# Altium project ZS-005.PrjPcb
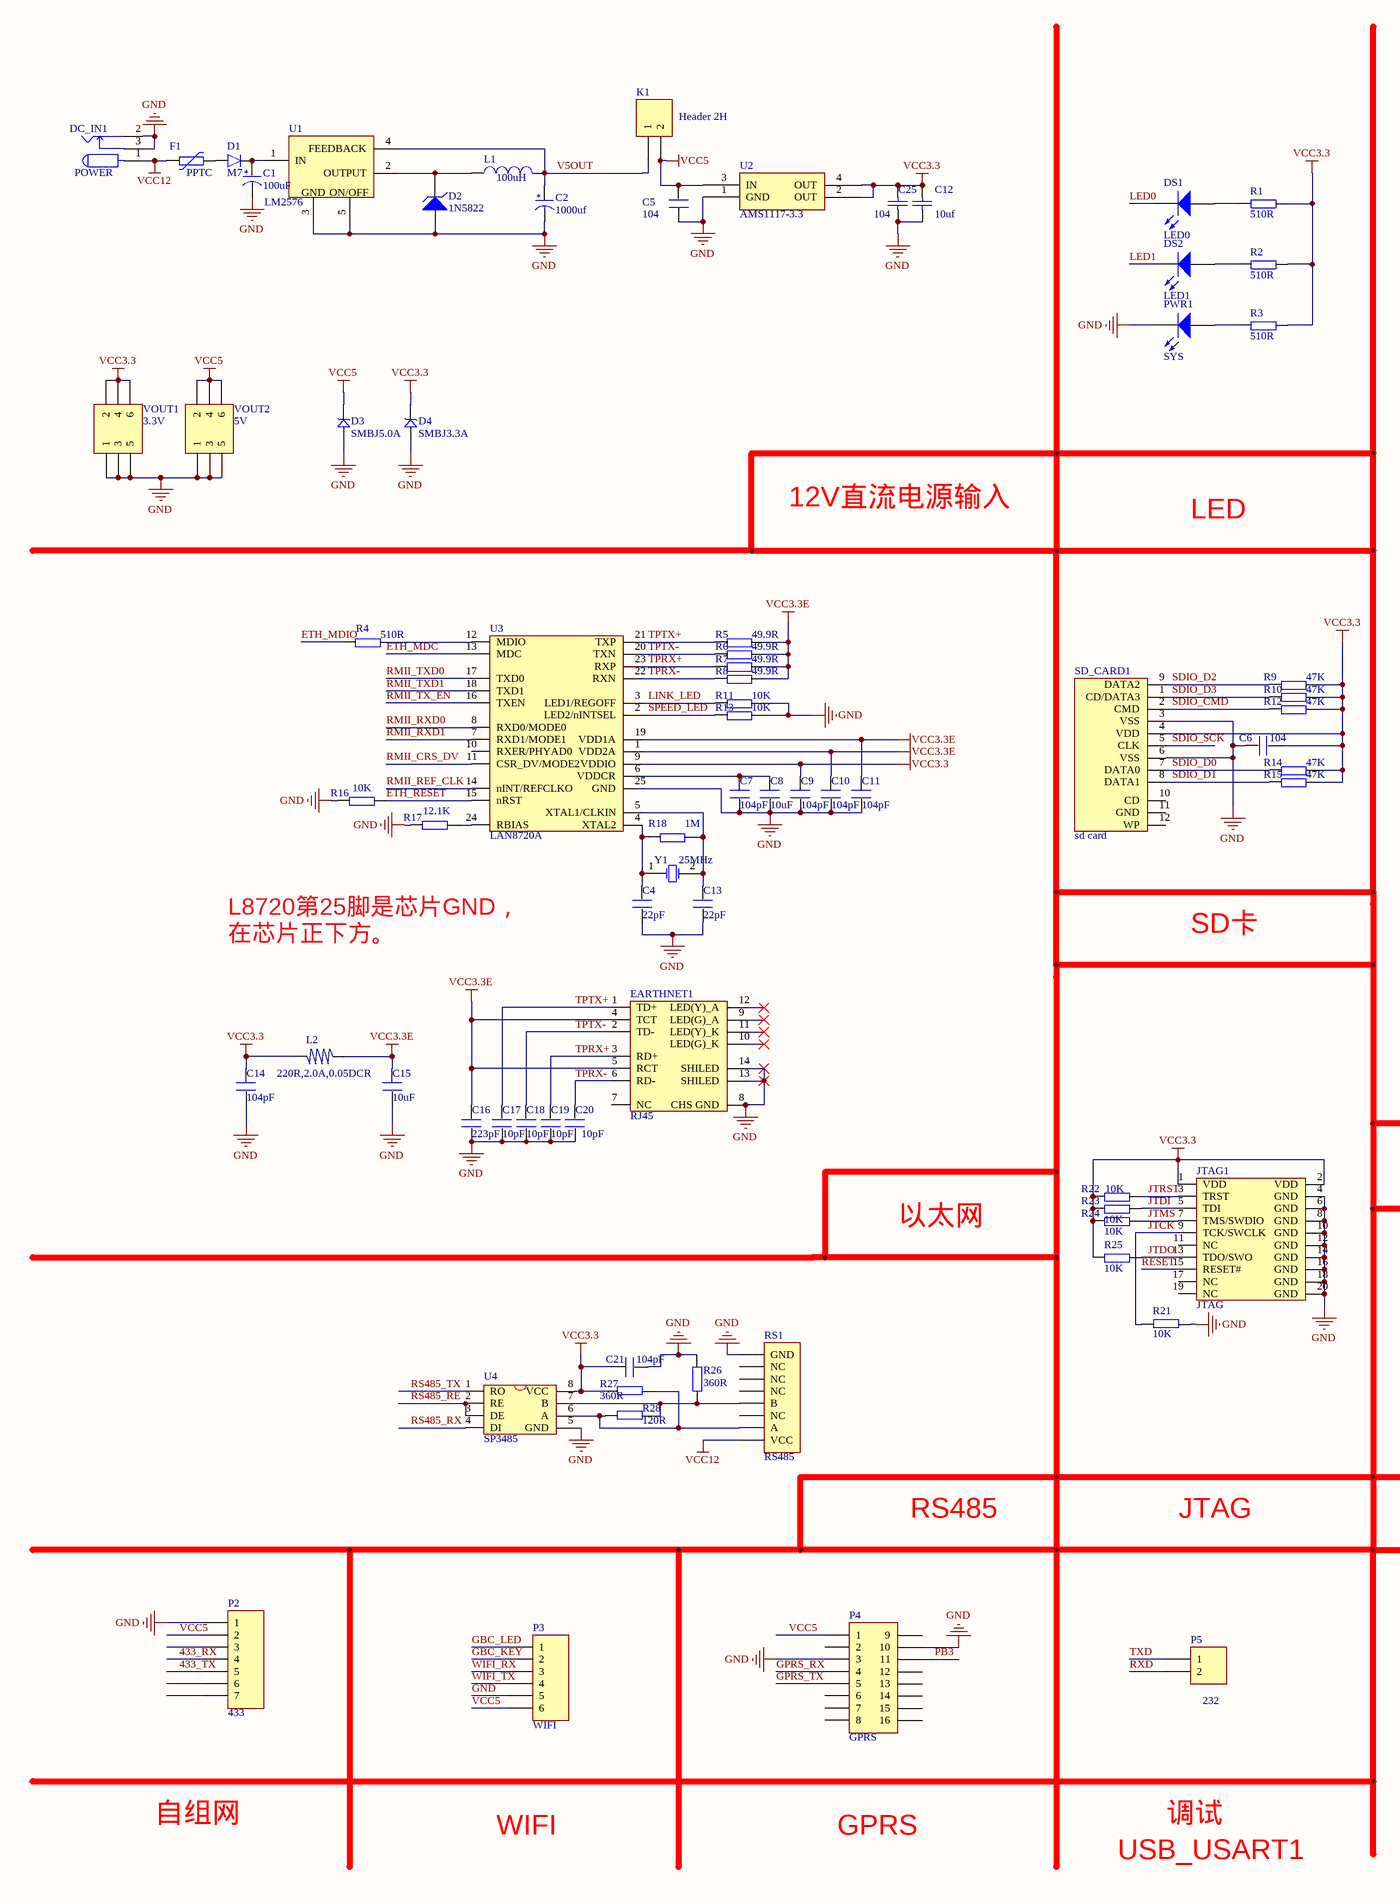
[diagram p0: MBoard.SchDoc, left]
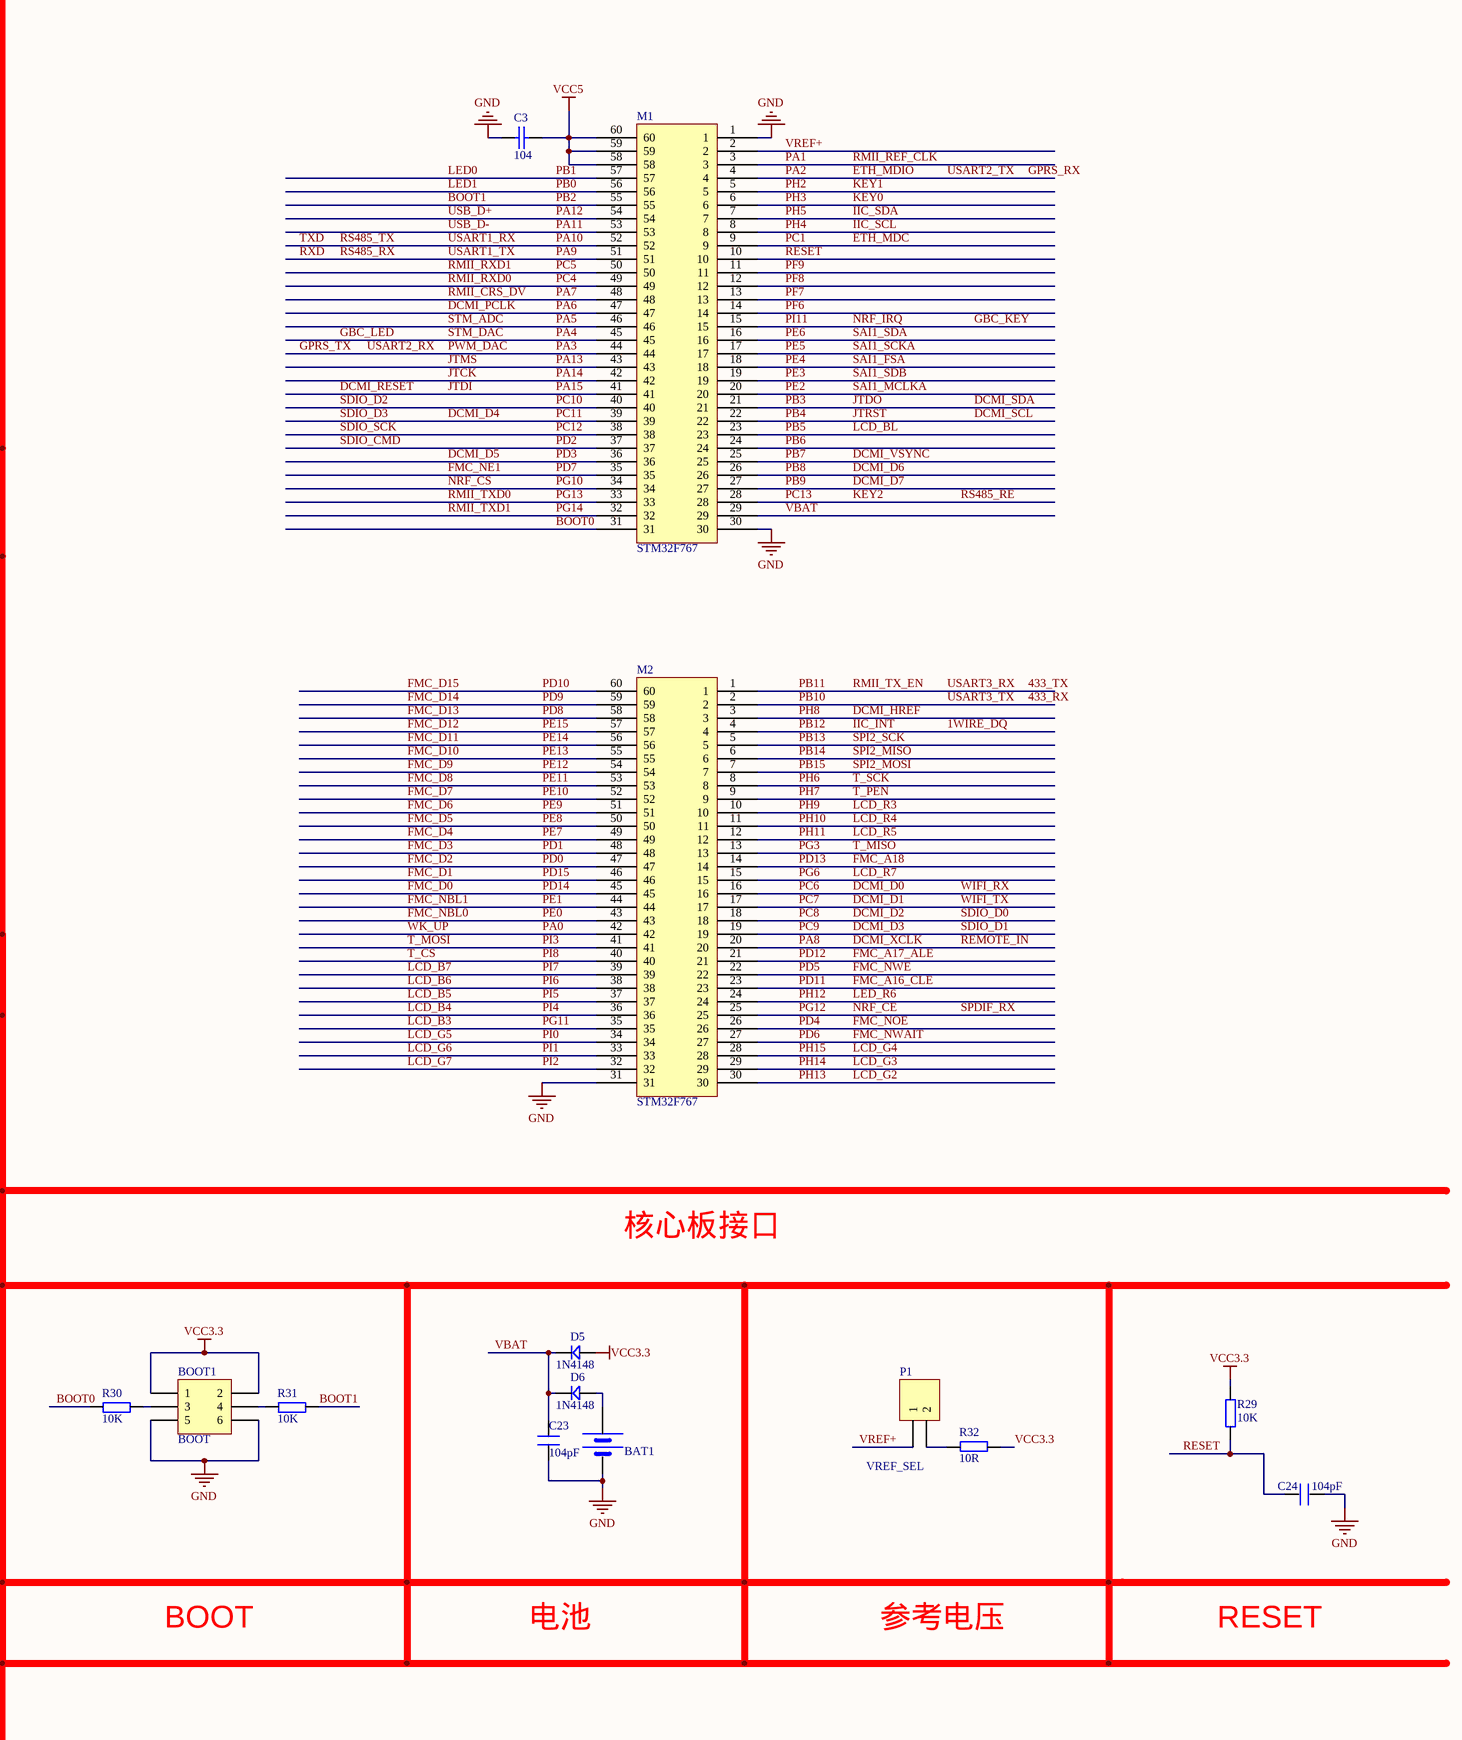
[diagram p1: MBoard.SchDoc, right]
1 sheet, 88 parts. Net scope: global (net labels, ports and power ports of the same name join across sheets).
Board file: ZS-005.PcbDoc

## Sheet MBoard.SchDoc
size A2

### Parts
BAT1  BATT  [BATM]  (value not drawn)
BOOT1  BOOT  [HDR2X3]
C1  100uF  [CC6.56.5]
C2  1000uf  [CC6.56.5]
C3  value 104  [c0603]  (hidden comment: Cap)
C4  22pF  [C0603]
C5  104  [C0603]
C6  104  [C0603]
C7  104pF  [C0603]
C8  10uF  [C0805]
C9  104pF  [C0603]
C10  104pF  [C0603]
C11  104pF  [C0603]
C12  10uf  [C0603]
C13  22pF  [C0603]
C14  104pF  [C0603]
C15  10uF  [C0805]
C16  223pF  [C0603]
C17  10pF  [C0603]
C18  10pF  [C0603]
C19  10pF  [C0603]
C20  10pF  [C0603]
C21  104pF  [C0603]
C23  104pF  [C0603]
C24  104pF  [C0603]
C25  value 104  [c0603]  (hidden comment: Cap)
D1  M7  [SMA (DO-214AC)]
D2  1N5822  [smb do214aa]
D3  SMBJ5.0A  [SMBJ]
D4  SMBJ3.3A  [SMBJ]
D5  1N4148  [Diode_MELF(1206)]
D6  1N4148  [Diode_MELF(1206)]
DC_IN1  POWER  [DC10B]
DS1  LED0  [SMDLED]
DS2  LED1  [SMDLED]
EARTHNET1  RJ45  [RJ45]
F1  PPTC  [1206]
JTAG1  JTAG  [JTAG_20]
K1  Header 2H  [HDR1X2]
L1  value 100uH  [l1212]
L2  220R,2.0A,0.05DCR  [R0603]
M1  STM32F767  [60pin]
M2  STM32F767  [60pin]
P1  VREF_SEL  [HDR1X2]
P2  433  [HDR1X7]
P3  WIFI  [HDR1X6]
P4  GPRS  [GPRS]
P5  232  [HDR1X2]
PWR1  SYS  [SMDLED]
R1  510R  [R0603]
R2  510R  [R0603]
R3  510R  [R0603]
R4  510R  [R0603]
R5  49.9R  [R0603]
R6  49.9R  [R0603]
R7  49.9R  [R0603]
R8  49.9R  [R0603]
R9  47K  [R0603]
R10  47K  [R0603]
R11  10K  [R0603]
R12  47K  [R0603]
R13  10K  [R0603]
R14  47K  [R0603]
R15  47K  [R0603]
R16  10K  [R0603]
R17  12.1K  [R0603]
R18  1M  [R0603]
R21  10K  [R0603]
R22  10K  [R0603]
R23  10K  [R0603]
R24  10K  [R0603]
R25  10K  [R0603]
R26  360R  [R0603]
R27  360R  [R0603]
R28  120R  [R0603]
R29  10K  [R0603]
R30  10K  [R0603]
R31  10K  [R0603]
R32  10R  [R0603]
RS1  RS485  [RJ45]
SD_CARD1  sd card  [SDCARD_L]
U1  LM2576  [TO-263-5]
U2  AMS1117-3.3  [AMS1117-3.3]
U3  LAN8720A  [QFN24]
U4  SP3485  [SOP-8]
VOUT1  3.3V  [HDR2X3]
VOUT2  5V  [HDR2X3]
Y1  25MHz  [XTAL_US]

### Nets
GND: BAT1.2(GND) BOOT1.5 BOOT1.6 C1.2(GND) C2.2(GND) C3.2 C4.1 C5.2 C6.1 C7.1 C8.1 C9.1 C10.1 C11.1 C12.1 C13.1 C14.1 C15.1 C16.1 C17.1 C18.1 C19.1 C20.1 C21.2 C23.1 C24.1 C25.1 D2.1(A) D3.1 D4.1 DC_IN1.2 DC_IN1.3 EARTHNET1.8(CHS_GND) EARTHNET1.13(SHILED) EARTHNET1.14(SHILED) JTAG1.4(GND) JTAG1.6(GND) JTAG1.8(GND) JTAG1.10(GND) JTAG1.12(GND) JTAG1.14(GND) JTAG1.16(GND) JTAG1.18(GND) JTAG1.20(GND) M1.1 M1.30 M2.31 P2.1 P3.5 P4.3 P4.10 PWR1.2(K) R11.2 R13.2 R16.1 R17.1 R21.1 R26.2 RS1.8(GND) SD_CARD1.3(VSS) SD_CARD1.6(VSS) U1.3 U1.5 U2.1(GND) U3.25(GND) U4.5(GND) VOUT1.1 VOUT1.3 VOUT1.5 VOUT2.1 VOUT2.3 VOUT2.5
VCC3.3: BOOT1.1 BOOT1.2 C6.2 C9.2 C12.2 C14.2 C21.1 C25.2 D4.2 D5.1 JTAG1.1(VDD) JTAG1.2(VDD) L2.2 R1.2 R2.2 R3.2 R9.2 R10.2 R12.2 R14.2 R15.2 R22.1 R23.1 R24.1 R25.1 R27.2 R29.2 R32.1 SD_CARD1.4(VDD) U2.2(OUT) U2.4(OUT) U3.9(VDDIO) U4.8(VCC) VOUT1.2 VOUT1.4 VOUT1.6
VCC3.3E: C10.2 C11.2 C15.2 C16.2 EARTHNET1.4(TCT) EARTHNET1.5(RCT) L2.1 R5.2 R6.2 R7.2 R8.2 U3.1(VDD2A) U3.19(VDD1A)
VCC5: C3.1 C5.1 D3.2 K1.2 M1.58 M1.59 M1.60 P2.2 P3.6 P4.1 U2.3(IN) VOUT2.2 VOUT2.4 VOUT2.6
VCC12: DC_IN1.1 F1.1 RS1.1(VCC)
1WIRE_DQ: M2.4  [also labelled IIC_INT, PB12]
433_RX: M2.2 P2.4  [also labelled PB10, USART3_TX]
433_TX: M2.1 P2.5 U3.16(TXEN)  [also labelled PB11, RMII_TX_EN, USART3_RX]
BOOT0: M1.31 R30.1
BOOT1: M1.55 R31.2  [also labelled PB2]
DCMI_D0: M2.16 P3.3  [also labelled PC6, WIFI_RX]
DCMI_D1: M2.17 P3.4  [also labelled PC7, WIFI_TX]
DCMI_D2: M2.18 R14.1 SD_CARD1.7(DATA0)  [also labelled PC8, SDIO_D0]
DCMI_D3: M2.19 R15.1 SD_CARD1.8(DATA1)  [also labelled PC9, SDIO_D1]
DCMI_D4: M1.39 R10.1 SD_CARD1.1(CD/DATA3)  [also labelled PC11, SDIO_D3]
DCMI_D5: M1.36  [also labelled PD3]
DCMI_D6: M1.26  [also labelled PB8]
DCMI_D7: M1.27  [also labelled PB9]
DCMI_HREF: M2.3  [also labelled PH8]
DCMI_PCLK: M1.47  [also labelled PA6]
DCMI_RESET: JTAG1.5(TDI) M1.41 R23.2  [also labelled JTDI, PA15]
DCMI_SCL: JTAG1.3(TRST) M1.22 R22.2  [also labelled JTRST, PB4]
DCMI_SDA: JTAG1.13(TDO/SWO) M1.21 P4.11 R25.2  [also labelled JTDO, PB3]
DCMI_VSYNC: M1.25  [also labelled PB7]
DCMI_XCLK: M2.20  [also labelled PA8, REMOTE_IN]
ETH_MDC: M1.9 U3.13(MDC)  [also labelled PC1]
ETH_MDIO: M1.4 P4.4 R4.1  [also labelled GPRS_RX, PA2, USART2_TX]
ETH_RESET: R16.2 U3.15(nRST)
FMC_A16_CLE: M2.23  [also labelled PD11]
FMC_A17_ALE: M2.21  [also labelled PD12]
FMC_A18: M2.14  [also labelled PD13]
FMC_D0: M2.45  [also labelled PD14]
FMC_D1: M2.46  [also labelled PD15]
FMC_D2: M2.47  [also labelled PD0]
FMC_D3: M2.48  [also labelled PD1]
FMC_D4: M2.49  [also labelled PE7]
FMC_D5: M2.50  [also labelled PE8]
FMC_D6: M2.51  [also labelled PE9]
FMC_D7: M2.52  [also labelled PE10]
FMC_D8: M2.53  [also labelled PE11]
FMC_D9: M2.54  [also labelled PE12]
FMC_D10: M2.55  [also labelled PE13]
FMC_D11: M2.56  [also labelled PE14]
FMC_D12: M2.57  [also labelled PE15]
FMC_D13: M2.58  [also labelled PD8]
FMC_D14: M2.59  [also labelled PD9]
FMC_D15: M2.60  [also labelled PD10]
FMC_NBL0: M2.43  [also labelled PE0]
FMC_NBL1: M2.44  [also labelled PE1]
FMC_NE1: M1.35  [also labelled PD7]
FMC_NOE: M2.26  [also labelled PD4]
FMC_NWAIT: M2.27  [also labelled PD6]
FMC_NWE: M2.22  [also labelled PD5]
GBC_KEY: M1.15 P3.2  [also labelled NRF_IRQ, PI11]
GBC_LED: M1.45 P3.1  [also labelled PA4, STM_DAC]
GPRS_TX: M1.44 P4.5  [also labelled PA3, PWM_DAC, USART2_RX]
IIC_SCL: M1.8  [also labelled PH4]
IIC_SDA: M1.7  [also labelled PH5]
JTCK: JTAG1.9(TCK/SWCLK) M1.42 R21.2  [also labelled PA14]
JTMS: JTAG1.7(TMS/SWDIO) M1.43 R24.2  [also labelled PA13]
KEY0: M1.6  [also labelled PH3]
KEY1: M1.5  [also labelled PH2]
KEY2: M1.28 U4.2(RE) U4.3(DE)  [also labelled PC13, RS485_RE]
LCD_B3: M2.35  [also labelled PG11]
LCD_B4: M2.36  [also labelled PI4]
LCD_B5: M2.37  [also labelled PI5]
LCD_B6: M2.38  [also labelled PI6]
LCD_B7: M2.39  [also labelled PI7]
LCD_BL: M1.23  [also labelled PB5]
LCD_G2: M2.30  [also labelled PH13]
LCD_G3: M2.29  [also labelled PH14]
LCD_G4: M2.28  [also labelled PH15]
LCD_G5: M2.34  [also labelled PI0]
LCD_G6: M2.33  [also labelled PI1]
LCD_G7: M2.32  [also labelled PI2]
LCD_R3: M2.10  [also labelled PH9]
LCD_R4: M2.11  [also labelled PH10]
LCD_R5: M2.12  [also labelled PH11]
LCD_R7: M2.15  [also labelled PG6]
LED0: DS1.2(K) M1.57  [also labelled PB1]
LED1: DS2.2(K) M1.56  [also labelled PB0]
LED_R6: M2.24  [also labelled PH12]
LINK_LED: R11.1 U3.3(LED1/REGOFF)
NRF_CE: M2.25  [also labelled PG12, SPDIF_RX]
NRF_CS: M1.34  [also labelled PG10]
PA0: M2.42  [also labelled WK_UP]
PA1: M1.3 U3.14(nINT/REFCLKO)  [also labelled RMII_REF_CLK]
PA5: M1.46  [also labelled STM_ADC]
PA7: M1.48 U3.11(CSR_DV/MODE2)  [also labelled RMII_CRS_DV]
PA9: M1.51 P5.2 U4.4(DI)  [also labelled RS485_RX, RXD, USART1_TX]
PA10: M1.52 P5.1 U4.1(RO)  [also labelled RS485_TX, TXD, USART1_RX]
PA11: M1.53  [also labelled USB_D-]
PA12: M1.54  [also labelled USB_D+]
PB6: M1.24
PB13: M2.5  [also labelled SPI2_SCK]
PB14: M2.6  [also labelled SPI2_MISO]
PB15: M2.7  [also labelled SPI2_MOSI]
PC4: M1.49 U3.8(RXD0/MODE0)  [also labelled RMII_RXD0]
PC5: M1.50 U3.7(RXD1/MODE1)  [also labelled RMII_RXD1]
PC10: M1.40 R9.1 SD_CARD1.9(DATA2)  [also labelled SDIO_D2]
PC12: M1.38 SD_CARD1.5(CLK)  [also labelled SDIO_SCK]
PD2: M1.37 R12.1 SD_CARD1.2(CMD)  [also labelled SDIO_CMD]
PE2: M1.20  [also labelled SAI1_MCLKA]
PE3: M1.19  [also labelled SAI1_SDB]
PE4: M1.18  [also labelled SAI1_FSA]
PE5: M1.17  [also labelled SAI1_SCKA]
PE6: M1.16  [also labelled SAI1_SDA]
PF6: M1.14
PF7: M1.13
PF8: M1.12
PF9: M1.11
PG3: M2.13  [also labelled T_MISO]
PG13: M1.33 U3.17(TXD0)  [also labelled RMII_TXD0]
PG14: M1.32 U3.18(TXD1)  [also labelled RMII_TXD1]
PH6: M2.8  [also labelled T_SCK]
PH7: M2.9  [also labelled T_PEN]
PI3: M2.41  [also labelled T_MOSI]
PI8: M2.40  [also labelled T_CS]
RESET: C24.2 JTAG1.15(RESET#) M1.10 R29.1
SPEED_LED: R13.1 U3.2(LED2/nINTSEL)
TPRX+: C19.2 EARTHNET1.3(RD+) R7.1 U3.23(RXP)
TPRX-: C20.2 EARTHNET1.6(RD-) R8.1 U3.22(RXN)
TPTX+: C17.2 EARTHNET1.1(TD+) R5.1 U3.21(TXP)
TPTX-: C18.2 EARTHNET1.2(TD-) R6.1 U3.20(TXN)
V5OUT: C2.1(VCC) K1.1 L1.2 U1.4(FEEDBACK)
VBAT: C23.2 D5.2 D6.2 M1.29
VREF+: M1.2 P1.1
NetBAT1_1: BAT1.1(VCC) D6.1
NetBOOT1_3: BOOT1.3 R30.2
NetBOOT1_4: BOOT1.4 R31.1
NetC1_1: C1.1(VCC) D1.1(-) U1.1(IN)
NetC4_2: C4.2 R18.1 U3.4(XTAL2) Y1.1(OSC1)
NetC7_2: C7.2 C8.2 U3.6(VDDCR)
NetC13_2: C13.2 R18.2 U3.5(XTAL1/CLKIN) Y1.2(OSC2)
NetD1_2: D1.2(+) F1.2
NetD2_2: D2.2(K) L1.1 U1.2(OUTPUT)
NetDS1_1: DS1.1(A) R1.1
NetDS2_1: DS2.1(A) R2.1
NetP1_2: P1.2 R32.2
NetPWR1_1: PWR1.1(A) R3.1
NetR4_2: R4.2 U3.12(MDIO)
NetR17_2: R17.2 U3.24(RBIAS)
NetR26_1: R26.1 R28.1 RS1.4(B) U4.7(B)
NetR27_1: R27.1 R28.2 RS1.2(A) U4.6(A)

Not connected (* = marked no-connect by the designer): EARTHNET1 7(NC) 9(LED(G)_A)* 10(LED(G)_K)* 11(LED(Y)_K)* 12(LED(Y)_A)*; JTAG1 11(NC) 17(NC) 19(NC); P2 3 6 7; P4 2 6 7 8 9 12 13 14 15 16; RS1 3(NC) 5(NC) 6(NC) 7(NC); SD_CARD1 10(CD) 11(GND) 12(WP); U3 10(RXER/PHYAD0)

### Notes on the sheet
- (near U1) GND
- (near U1) ON/OFF
- 12V直流电源输入
- LED
- L8720第25脚是芯片GND，在芯片正下方。
- SD卡
- 核心板接口
- 以太网
- RS485
- JTAG
- BOOT
- 电池
- 参考电压
- RESET
- 自组网
- WIFI
- GPRS
- USB_USART1
- 调试

### Library data of the parts
BAT1 = BAT
BOOT1 VOUT1 VOUT2 = Header 3X2: Header, 3-Pin, Dual row; LatestRevisionDate: 17-Jul-2002; LatestRevisionNote: Re-released for DXP Platform.; Publisher: Altium Limited
C1 C2 = CAP
C3 C25 = Cap: Capacitor; Published: 8-Jun-2000; LatestRevisionDate: 17-Jul-2002; LatestRevisionNote: Re-released for DXP Platform.; PackageReference: RAD-0.3; Publisher: Altium Limited; PackageDescription: Radial Cap, Thru-Hole; 2 Leads; 0.3 in Pin Spacing
C4-C11 C13-C21 C23 C24 = C
C12 = Cap: 50V/8.2u/0805; Value: 100n; Published: 8-Jun-2000; LatestRevisionDate: 17-Jul-2002; LatestRevisionNote: Re-released for DXP Platform.; PackageReference: RAD-0.3; Publisher: Altium Limited
D2 = D Zener: Zener Diode; Published: 8-Jun-2000; LatestRevisionDate: 17-Jul-2002; LatestRevisionNote: Re-released for DXP Platform.; PackageReference: DIODE-0.7; Publisher: Altium Limited; PackageDescription: Diode, Thru-Hole; 2 Leads; 0.7 in Pin Spacing
D3 D4 = SMBJ: TVS
D5 D6 = D
DC_IN1 = POW
DS1 DS2 PWR1 = LED2: Typical RED, GREEN, YELLOW, AMBER GaAs LED; Published: 8-Jun-2000; LatestRevisionDate: 17-Jul-2002; LatestRevisionNote: Re-released for DXP Platform.; PackageDocument: Feb-2002; PackageReference: 3.2X1.6X1.1; Publisher: Altium Limited
EARTHNET1 = HR911105
K1 = Header 2H: Header, 2-Pin, Right Angle; LatestRevisionDate: 17-Jul-2002; LatestRevisionNote: Re-released for DXP Platform.; Publisher: Altium Limited
L1 = Inductor: Code_IEC: 1005; Published: 8-Jun-2000; LatestRevisionDate: 29-May-2009; LatestRevisionNote: IPC-7351 Footprint Added.; PackageReference: 0402-A; Publisher: Altium Limited; PackageDescription: Chip Inductor; Code_JEITA: 0402
L2 = L
M1 M2 = J1
P1 P5 = Header 2: Header, 2-Pin; LatestRevisionDate: 17-Jul-2002; LatestRevisionNote: Re-released for DXP Platform.; Publisher: Altium Limited
P2 = Header 7: Header, 7-Pin; LatestRevisionDate: 17-Jul-2002; LatestRevisionNote: Re-released for DXP Platform.; Publisher: Altium Limited
P3 = Header 6H: Header, 6-Pin, Right Angle; LatestRevisionDate: 17-Jul-2002; LatestRevisionNote: Re-released for DXP Platform.; Publisher: Altium Limited
P4 = Header 8X2A: Header, 8-Pin, Dual row; LatestRevisionDate: 17-Jul-2002; LatestRevisionNote: Re-released for DXP Platform.; Publisher: Altium Limited
R1-R18 R21-R32 = R
RS1 = Header 8: Header, 8-Pin; LatestRevisionDate: 17-Jul-2002; LatestRevisionNote: Re-released for DXP Platform.; Publisher: Altium Limited
U3 = LAN8720: ETH PHY
U4 = MAX3485
Y1 = XTAL: Crystal Oscillator; Published: 8-Jun-2000; LatestRevisionDate: 17-Jul-2002; LatestRevisionNote: Re-released for DXP Platform.; Publisher: Altium Limited